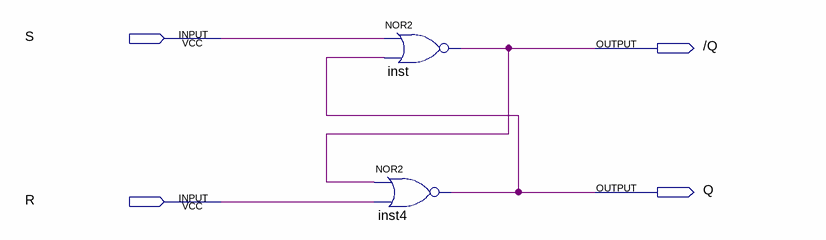
[diagram p0: schematic sheet]
// Quartus schematic SR_Latch.bdf as structural Verilog: 2 symbols, 4 pins
module SR_Latch (
  input  S,
  input  R,
  output \/Q ,
  output Q
);

  nor inst (\/Q , S, Q);
  nor inst4 (Q, \/Q , R);
endmodule
